# Altium schematic sheet cc-tester.SchDoc
size A3
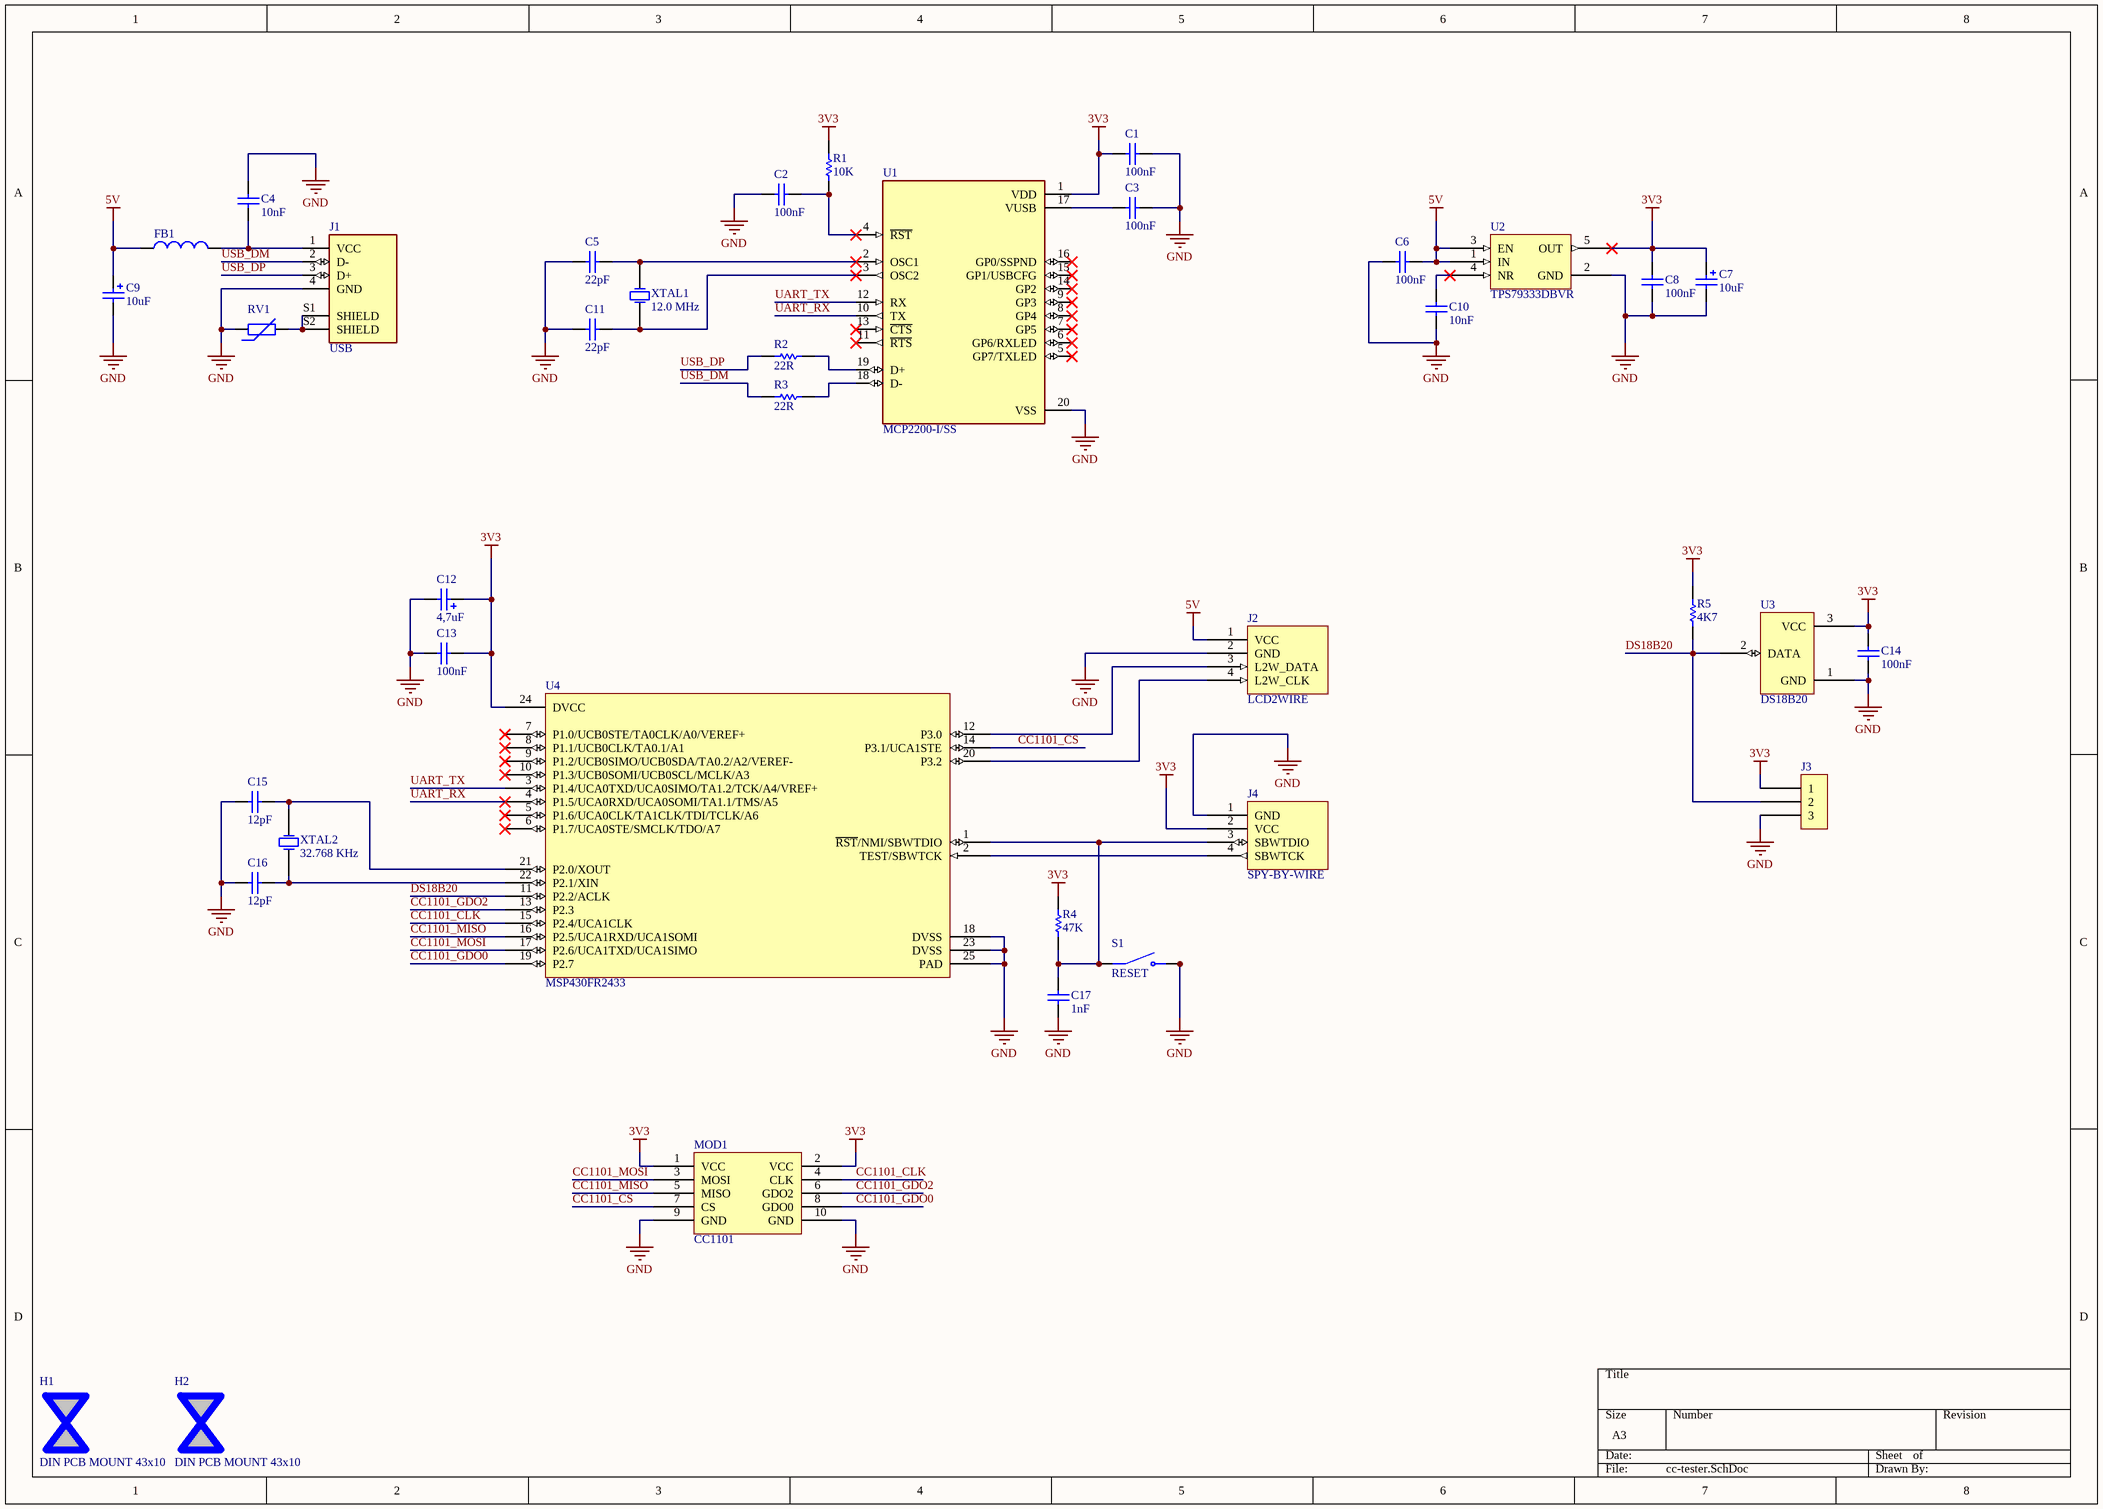
[diagram p0: cc-tester.SchDoc]

## Parts
C1  100nF  [SMD 0603 GENERIC]
C2  100nF  [SMD 0603 GENERIC]
C3  100nF  [SMD 0603 GENERIC]
C4  10nF  [SMD 0603 GENERIC]
C5  22pF  [SMD 0805 GENERIC]
C6  100nF  [SMD 0603 GENERIC]
C7  10uF  [SMD 1206 POLARIZED]
C8  100nF  [SMD 0603 GENERIC]
C9  10uF  [SMD 1206 POLARIZED]
C10  10nF  [SMD 0603 GENERIC]
C11  22pF  [SMD 0805 GENERIC]
C12  4,7uF  [SMD 1206 POLARIZED]
C13  100nF  [SMD 0603 GENERIC]
C14  100nF  [SMD 0603 GENERIC]
C15  12pF  [SMD 0603 GENERIC]
C16  12pF  [SMD 0603 GENERIC]
C17  1nF  [SMD 0603 GENERIC]
FB1  11R 100 MHz 1.5A  [SMD 0805 GENERIC]  (value not drawn)
H1  DIN PCB MOUNT 43x10  [DIN PCB MOUNT 43x10]
H2  DIN PCB MOUNT 43x10  [DIN PCB MOUNT 43x10]
J1  USB  [THT CON USB 2.0 RA]
J2  LCD2WIRE  [THT CON 4-PIN 2.54 WHITE]
J3  (no value)  [THT CON TE 1744418-3 2.5]
J4  SPY-BY-WIRE  [THT CON 4-PIN 2.54 WHITE]
MOD1  CC1101  [THT MOD CC1101 433 MHz AMAZON]
R1  10K  [SMD 0603 GENERIC]
R2  22R  [SMD 0603 GENERIC]
R3  22R  [SMD 0603 GENERIC]
R4  47K  [SMD 0603 GENERIC]
R5  4K7  [SMD 0603 GENERIC]
RV1  18VDC 180pF  [SMD 0805 GENERIC]  (value not drawn)
S1  RESET  [THT SWC OMRON B3F-1022]
U1  MCP2200-I/SS  [SMD SSOP-20]
U2  TPS79333DBVR  [SOT23-5]
U3  DS18B20  [THT TO-92 SMALL]
U4  MSP430FR2433  [VQFN-24]
XTAL1  12.0 MHz  [THT XTAL HC49]
XTAL2  32.768 KHz  [SMD-2 XTAL ABRACON]

## Nets
3V3: C1.1 C7.1 C8.2 C12.1 C13.2 C14.2 J3.1 J4.2(VCC) MOD1.1(VCC) MOD1.2(VCC) R1.2 R4.2 R5.2 U1.1(VDD) U2.5(OUT) U3.3(VCC) U4.24(DVCC)
5V: C6.2 C9.1 FB1.1 J2.1(VCC) U2.1(IN) U2.3(EN)
GND: C1.2 C2.1 C3.2 C4.2 C5.1 C6.1 C7.2 C8.1 C9.2 C10.1 C11.1 C12.2 C13.1 C14.1 C15.1 C16.1 C17.1 J1.4(GND) J2.2(GND) J3.3 J4.1(GND) MOD1.9(GND) MOD1.10(GND) RV1.1 S1.3(NO) S1.4(NO) U1.20(VSS) U2.2(GND) U3.1(GND) U4.18(DVSS) U4.23(DVSS) U4.25(PAD)
CC1101_CLK: MOD1.4(CLK) U4.15(P2.4/UCA1CLK)
CC1101_CS: MOD1.7(CS) U4.14(P3.1/UCA1STE)
CC1101_GDO0: MOD1.8(GDO0) U4.19(P2.7)
CC1101_GDO2: MOD1.6(GDO2) U4.13(P2.3)
CC1101_MISO: MOD1.5(MISO) U4.16(P2.5/UCA1RXD/UCA1SOMI)
CC1101_MOSI: MOD1.3(MOSI) U4.17(P2.6/UCA1TXD/UCA1SIMO)
DS18B20: J3.2 R5.1 U3.2(DATA) U4.11(P2.2/ACLK)
UART_RX: U1.10(TX) U4.4(P1.5/UCA0RXD/UCA0SOMI/TA1.1/TMS/A5)
UART_TX: U1.12(RX) U4.3(P1.4/UCA0TXD/UCA0SIMO/TA1.2/TCK/A4/VREF+)
USB_DM: J1.2(D-) R3.1
USB_DP: J1.3(D+) R2.1
NetC2_2: C2.2 R1.1 U1.4(~{RST})
NetC3_1: C3.1 U1.17(VUSB)
NetC4_1: C4.1 FB1.2 J1.1(VCC)
NetC5_2: C5.2 U1.2(OSC1) XTAL1.2(OSC2)
NetC10_2: C10.2 U2.4(NR)
NetC11_2: C11.2 U1.3(OSC2) XTAL1.1(OSC1)
NetC15_2: C15.2 U4.21(P2.0/XOUT) XTAL2.2(OSC2)
NetC16_2: C16.2 U4.22(P2.1/XIN) XTAL2.1(OSC1)
NetC17_2: C17.2 J4.3(SBWTDIO) R4.1 S1.1(COM) S1.2(COM) U4.1(~{RST}/NMI/SBWTDIO)
NetJ1_S1: J1.S1(SHIELD) J1.S2(SHIELD) RV1.2
NetJ2_3: J2.3(L2W_DATA) U4.12(P3.0)
NetJ2_4: J2.4(L2W_CLK) U4.20(P3.2)
NetJ4_4: J4.4(SBWTCK) U4.2(TEST/SBWTCK)
NetR2_2: R2.2 U1.19(D+)
NetR3_2: R3.2 U1.18(D-)

Not connected (* = marked no-connect by the designer): U1 5(GP7/TXLED)* 6(GP6/RXLED)* 7(GP5)* 8(GP4)* 9(GP3)* 11(~{RTS})* 13(~{CTS})* 14(GP2)* 15(GP1/USBCFG)* 16(GP0/SSPND)*; U4 5(P1.6/UCA0CLK/TA1CLK/TDI/TCLK/A6)* 6(P1.7/UCA0STE/SMCLK/TDO/A7)* 7(P1.0/UCB0STE/TA0CLK/A0/VEREF+)* 8(P1.1/UCB0CLK/TA0.1/A1)* 9(P1.2/UCB0SIMO/UCB0SDA/TA0.2/A2/VEREF-)* 10(P1.3/UCB0SOMI/UCB0SCL/MCLK/A3)*

## Library data of the parts
C1-C3 C6 C8 C13 C14 = CAP SMD CER 100nF 16V 10% X7R 0603
C4 C10 = CAP SMD CER 10nF 16V 10% X7R 0603
C5 C11 = CAP SMD CER 22pF 50V 5% C0G 0805
C7 C9 = CAP SMD TAN 10uF 16V 10% 1206
C12 = CAP SMD TAN 4,7uF 35V 10% 1206
C15 C16 = CAP SMD CER 12pF 25V 10% C0G 0603
C17 = CAP SMD CER 1nF 16V 10% X7R 0603
FB1 = FBD SMD 11R 100MHz 1.5A 0805
J1 = CON THT USB 2.0 B RA: USB-B (USB TYPE-B) USB 2.0 Receptacle Connector 4 Position Through Hole, Right Angle
J2 = CON THT LCD2WIRE 4-PIN 2.54
J3 = CON THT TE 1744418-3 3-PIN 2.5
J4 = CON THT SPY-BY-WIRE 4-PIN 2.54
MOD1 = MOD RF CC1101 433 MHz AMAZON
R1 = RES SMD 10K 1% 0603
R2 R3 = RES SMD 22R 1% 0603
R4 = RES SMD 47K 1% 0603
R5 = RES SMD 4K7 1% 0603
RV1 = VAR SMD 18VDC 180pF 0805
S1 = SWC OMRON B3F-1022
U1 = COM TRN UART MCP2200-I/SS
U2 = PWR TPS79333DBVR
U3 = SNS TMP DS18B20
U4 = MCU MSP430FR2433IRGET
XTAL1 = XTAL THT 12.0 MHz HC49
XTAL2 = XTAL SMD 32.768 KHz ABRACON